# Altium schematic sheet mcu.SchDoc
size A2
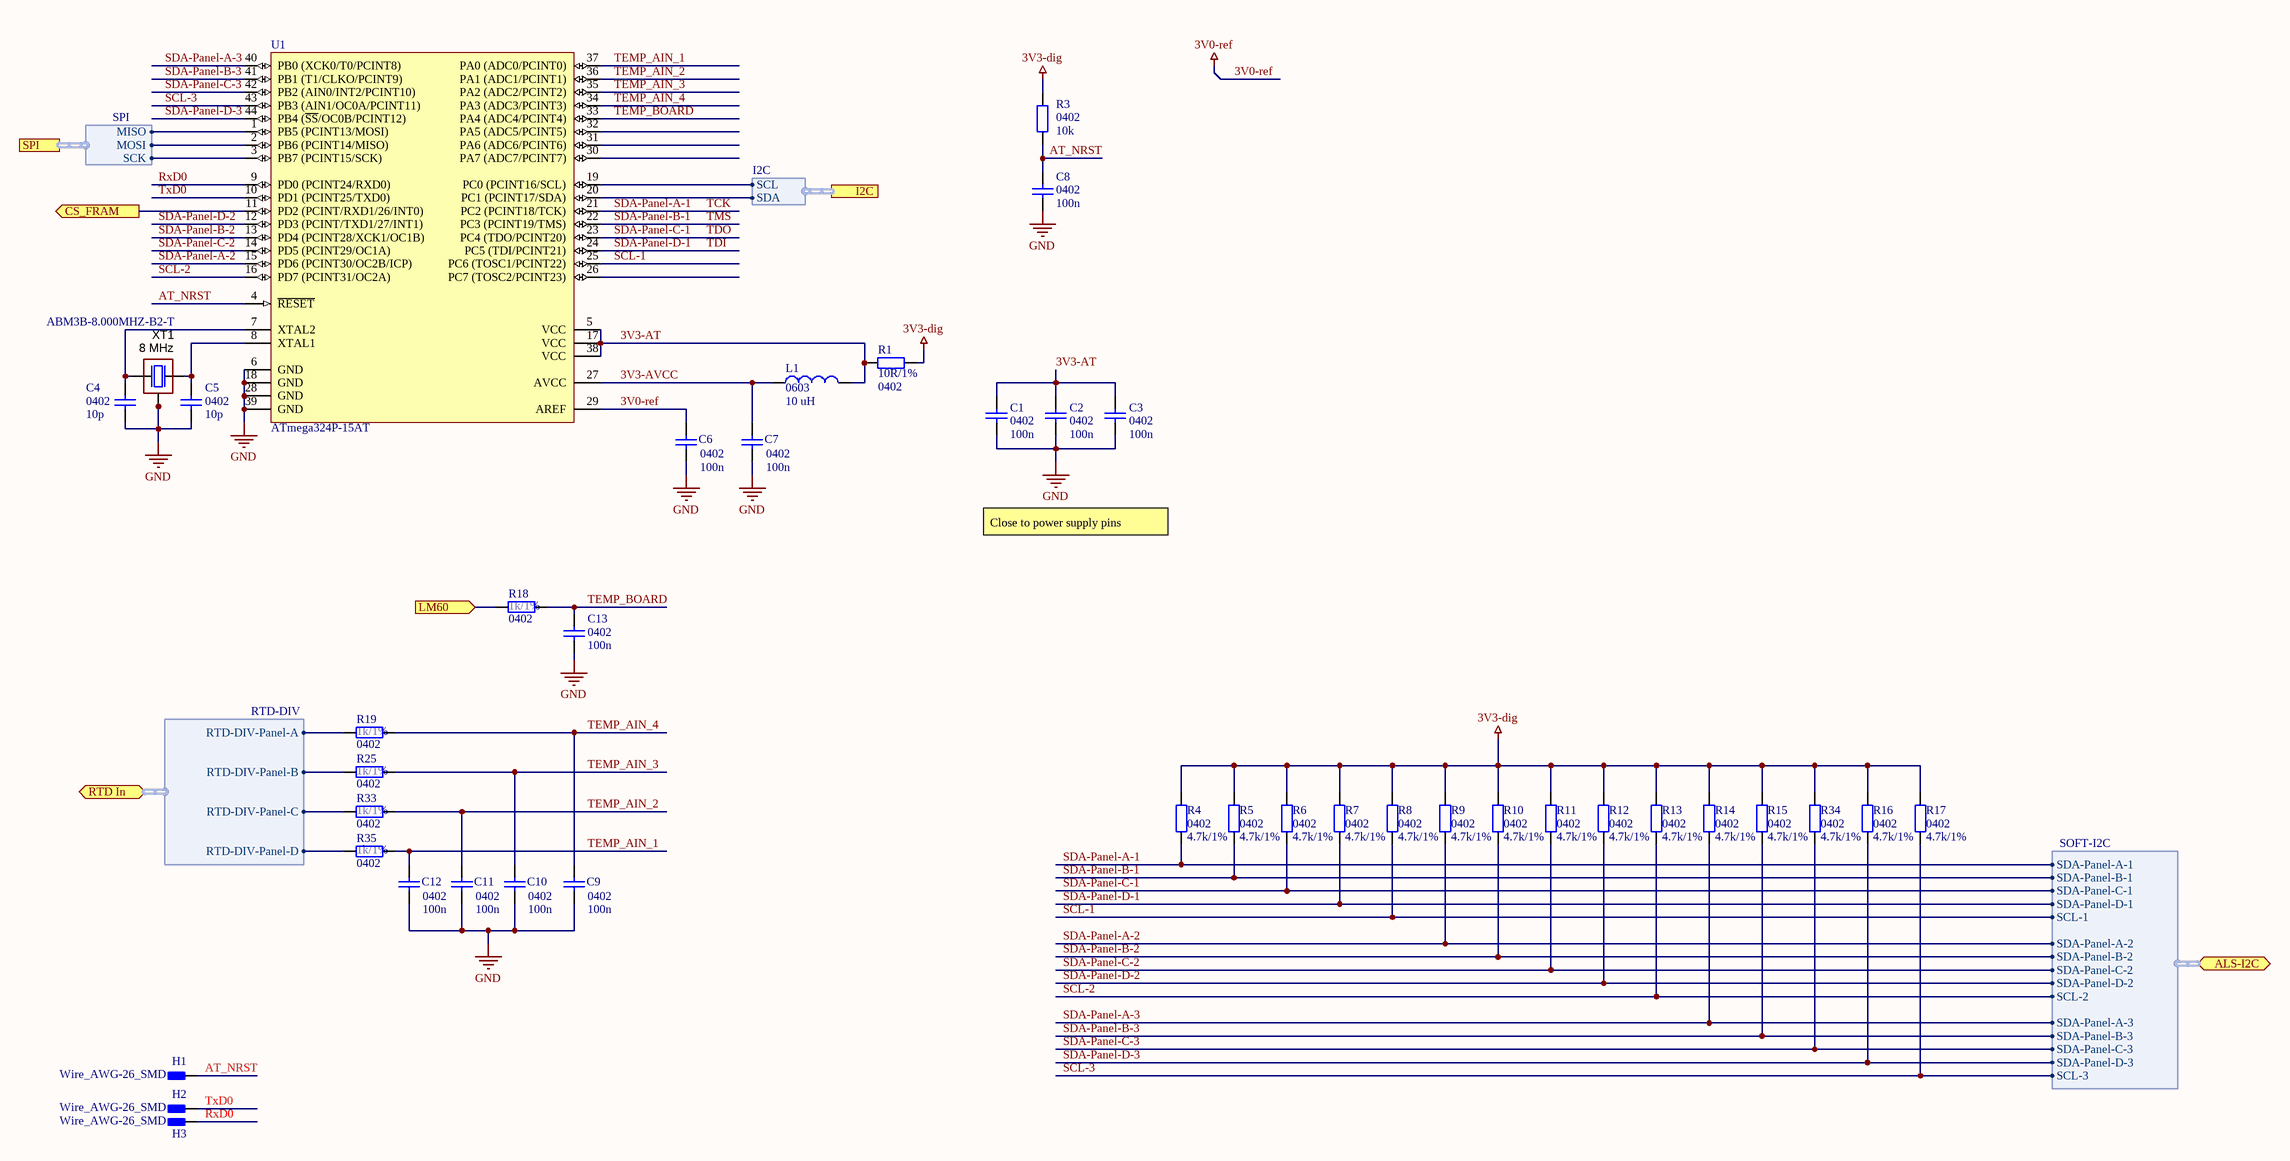
[diagram p0: mcu.SchDoc]

## Parts
C1  0402  value 100n  [SMD_Capacitor_0402]
C2  0402  value 100n  [SMD_Capacitor_0402]
C3  0402  value 100n  [SMD_Capacitor_0402]
C4  0402  value 10p  [SMD_Capacitor_0402]
C5  0402  value 10p  [SMD_Capacitor_0402]
C6  0402  value 100n  [SMD_Capacitor_0402]
C7  0402  value 100n  [SMD_Capacitor_0402]
C8  0402  value 100n  [SMD_Capacitor_0402]
C9  0402  value 100n  [SMD_Capacitor_0402]
C10  0402  value 100n  [SMD_Capacitor_0402]
C11  0402  value 100n  [SMD_Capacitor_0402]
C12  0402  value 100n  [SMD_Capacitor_0402]
C13  0402  value 100n  [SMD_Capacitor_0402]
H1  Wire_AWG-26_SMD  [Wire_AWG-26_SMD]
H2  Wire_AWG-26_SMD  [Wire_AWG-26_SMD]
H3  Wire_AWG-26_SMD  [Wire_AWG-26_SMD]
L1  10 uH  PackageReference: 0603  [SMD_Resistor_0603]
R1  Package: 0402  [SMD_Resistor_0402]  (hidden comment: 10R/1%)
R3  0402  value 10k  [SMD_Capacitor_0402]
R4  Package: 0402  [SMD_Resistor_0402]  (hidden comment: 4.7k/1%)
R5  Package: 0402  [SMD_Resistor_0402]  (hidden comment: 4.7k/1%)
R6  Package: 0402  [SMD_Resistor_0402]  (hidden comment: 4.7k/1%)
R7  Package: 0402  [SMD_Resistor_0402]  (hidden comment: 4.7k/1%)
R8  Package: 0402  [SMD_Resistor_0402]  (hidden comment: 4.7k/1%)
R9  Package: 0402  [SMD_Resistor_0402]  (hidden comment: 4.7k/1%)
R10  Package: 0402  [SMD_Resistor_0402]  (hidden comment: 4.7k/1%)
R11  Package: 0402  [SMD_Resistor_0402]  (hidden comment: 4.7k/1%)
R12  Package: 0402  [SMD_Resistor_0402]  (hidden comment: 4.7k/1%)
R13  Package: 0402  [SMD_Resistor_0402]  (hidden comment: 4.7k/1%)
R14  Package: 0402  [SMD_Resistor_0402]  (hidden comment: 4.7k/1%)
R15  Package: 0402  [SMD_Resistor_0402]  (hidden comment: 4.7k/1%)
R16  Package: 0402  [SMD_Resistor_0402]  (hidden comment: 4.7k/1%)
R17  Package: 0402  [SMD_Resistor_0402]  (hidden comment: 4.7k/1%)
R18  Package: 0402  [SMD_Resistor_0402]  (hidden comment: 1k/1%)
R19  Package: 0402  [SMD_Resistor_0402]  (hidden comment: 1k/1%)
R25  Package: 0402  [SMD_Resistor_0402]  (hidden comment: 1k/1%)
R33  Package: 0402  [SMD_Resistor_0402]  (hidden comment: 1k/1%)
R34  Package: 0402  [SMD_Resistor_0402]  (hidden comment: 4.7k/1%)
R35  Package: 0402  [SMD_Resistor_0402]  (hidden comment: 1k/1%)
U1  ATmega324P-15AT  [44ML_N]
XT1  8 MHz  [SMD, 5mm x 3.2mm]

## Ports
ALS-I2C (harness SOFT-I2C), CS_FRAM (out), I2C (harness I2C), LM60 (in), RTD In (harness RTD-DIV), SPI (harness SPI)

## Harnesses
SPI: MOSI, MISO, SCK
I2C: SCL, SDA
RTD-DIV: RTD-DIV-Panel-A, RTD-DIV-Panel-B, RTD-DIV-Panel-C, RTD-DIV-Panel-D
SOFT-I2C: SDA-Panel-A-1, SDA-Panel-D-1, SDA-Panel-B-1, SDA-Panel-C-1, SCL-1, SDA-Panel-A-2, SDA-Panel-D-2, SDA-Panel-B-2, SDA-Panel-C-2, SCL-2, SDA-Panel-A-3, SDA-Panel-D-3, SDA-Panel-B-3, SDA-Panel-C-3, SCL-3

## Nets
3V0-ref: C6.2 U1.29(AREF)
3V3-dig: R1.1 R3.2 R4.1 R5.1 R6.1 R7.1 R8.1 R9.1 R10.1 R11.1 R12.1 R13.1 R14.1 R15.1 R16.1 R17.1 R34.1
GND: C1.1 C2.1 C3.1 C4.1 C5.1 C6.1 C7.1 C8.1 C9.1 C10.1 C11.1 C12.1 C13.1 U1.6(GND) U1.18(GND) U1.28(GND) U1.39(GND) XT1.3(GND) XT1.4(GND)
3V3-AT: C1.2 C2.2 C3.2 L1.2 R1.2 U1.5(VCC) U1.17(VCC) U1.38(VCC)
3V3-AVCC: C7.2 L1.1 U1.27(AVCC)
AT_NRST: C8.2 H1.1 R3.1 U1.4(~{RESET})
CS_FRAM: U1.11(PD2_(PCINT/RXD1/26/INT0)) ; port CS_FRAM
LM60: R18.1 ; port LM60
RxD0: H3.1 U1.9(PD0_(PCINT24/RXD0))
SCL-1: R8.2 U1.25(PC6_(TOSC1/PCINT22)) ; port ALS-I2C.SCL-1
SCL-2: R13.2 U1.16(PD7_(PCINT31/OC2A)) ; port ALS-I2C.SCL-2
SCL-3: R17.2 U1.43(PB3_(AIN1/OC0A/PCINT11)) ; port ALS-I2C.SCL-3
SDA-Panel-A-1: R4.2 U1.21(PC2_(PCINT18/TCK)) ; port ALS-I2C.SDA-Panel-A-1  [also labelled TCK]
SDA-Panel-A-2: R9.2 U1.15(PD6_(PCINT30/OC2B/ICP)) ; port ALS-I2C.SDA-Panel-A-2
SDA-Panel-A-3: R14.2 U1.40(PB0_(XCK0/T0/PCINT8)) ; port ALS-I2C.SDA-Panel-A-3
SDA-Panel-B-1: R5.2 U1.22(PC3_(PCINT19/TMS)) ; port ALS-I2C.SDA-Panel-B-1  [also labelled TMS]
SDA-Panel-B-2: R10.2 U1.13(PD4_(PCINT28/XCK1/OC1B)) ; port ALS-I2C.SDA-Panel-B-2
SDA-Panel-B-3: R15.2 U1.41(PB1_(T1/CLKO/PCINT9)) ; port ALS-I2C.SDA-Panel-B-3
SDA-Panel-C-1: R6.2 U1.23(PC4_(TDO/PCINT20)) ; port ALS-I2C.SDA-Panel-C-1  [also labelled TDO]
SDA-Panel-C-2: R11.2 U1.14(PD5_(PCINT29/OC1A)) ; port ALS-I2C.SDA-Panel-C-2
SDA-Panel-C-3: R34.2 U1.42(PB2_(AIN0/INT2/PCINT10)) ; port ALS-I2C.SDA-Panel-C-3
SDA-Panel-D-1: R7.2 U1.24(PC5_(TDI/PCINT21)) ; port ALS-I2C.SDA-Panel-D-1  [also labelled TDI]
SDA-Panel-D-2: R12.2 U1.12(PD3_(PCINT/TXD1/27/INT1)) ; port ALS-I2C.SDA-Panel-D-2
SDA-Panel-D-3: R16.2 U1.44(PB4_(~{SS}/OC0B/PCINT12)) ; port ALS-I2C.SDA-Panel-D-3
TEMP_AIN_1: C12.2 R35.2 U1.37(PA0_(ADC0/PCINT0))
TEMP_AIN_2: C11.2 R33.2 U1.36(PA1_(ADC1/PCINT1))
TEMP_AIN_3: C10.2 R25.2 U1.35(PA2_(ADC2/PCINT2))
TEMP_AIN_4: C9.2 R19.2 U1.34(PA3_(ADC3/PCINT3))
TEMP_BOARD: C13.2 R18.2 U1.33(PA4_(ADC4/PCINT4))
TxD0: H2.1 U1.10(PD1_(PCINT25/TXD0))
NetC4_2: C4.2 U1.7(XTAL2) XT1.1(inp)
NetC5_2: C5.2 U1.8(XTAL1) XT1.2(out)
NetR19_1: R19.1 ; port RTD In.RTD-DIV-Panel-A
NetR25_1: R25.1 ; port RTD In.RTD-DIV-Panel-B
NetR33_1: R33.1 ; port RTD In.RTD-DIV-Panel-C
NetR35_1: R35.1 ; port RTD In.RTD-DIV-Panel-D
NetU1_1: U1.1(PB5_(PCINT13/MOSI)) ; port SPI.MISO
NetU1_2: U1.2(PB6_(PCINT14/MISO)) ; port SPI.MOSI
NetU1_3: U1.3(PB7_(PCINT15/SCK)) ; port SPI.SCK
NetU1_19: U1.19(PC0_(PCINT16/SCL)) ; port I2C.SCL
NetU1_20: U1.20(PC1_(PCINT17/SDA)) ; port I2C.SDA

Not connected (* = marked no-connect by the designer): U1 26(PC7_(TOSC2/PCINT23)) 30(PA7_(ADC7/PCINT7)) 31(PA6_(ADC6/PCINT6)) 32(PA5_(ADC5/PCINT5))

## Notes on the sheet
- Close to power supply pins
- Title:
- Sheet:
- of
- Author:
- Model:
- File name:
- Document Number:
- Checked by:
- Iss-Rev:
- Approved by:
- Date:

## Library data of the parts
C1-C3 C6-C13 = Cap: Capacitor; Published: 8-Jun-2000; LatestRevisionDate: 17-Jul-2002; LatestRevisionNote: Re-released for DXP Platform.; PackageReference: RAD-0.3; Publisher: Altium Limited; PackageDescription: Radial Cap, Thru-Hole; 2 Leads; 0.3 in Pin Spacing
C4 C5 = Cap1: Capacitor; Published: 8-Jun-2000; LatestRevisionDate: 17-Jul-2002; LatestRevisionNote: Re-released for DXP Platform.; PackageReference: RAD-0.3; Publisher: Altium Limited; PackageDescription: Radial Cap, Thru-Hole; 2 Leads; 0.3 in Pin Spacing
H1-H3 = Wire_AWG-26_SMD: SMD wire solder point.; Value: Wire_AWG-26_SMD
L1 = Inductor: Code_IEC: 1005; Published: 8-Jun-2000; LatestRevisionDate: 29-May-2009; LatestRevisionNote: IPC-7351 Footprint Added.; Publisher: Altium Limited; PackageDescription: Chip Inductor; Code_JEITA: 0402; Value: 10 uH
R1 = CRCW040210R0FKxxxx: 10R/1% Vishay CRCW 0402 Resistor. 63mW, 100ppm, 50V.; Manufacturer: Vishay; ManufacturerPartNumber: CRCW040210R0FKxxxx; Value: 10R/1%
R3 = Res2: Resistor; Published: 8-Jun-2000; LatestRevisionDate: 17-Jul-2002; LatestRevisionNote: Re-released for DXP Platform.; PackageReference: AXIAL-0.4; Publisher: Altium Limited; PackageDescription: Axial Device, Thru-Hole; 2 Leads; 0.4 in Pin Spacing
R4-R17 R34 = CRCW04024K70FKxxxx: 4.7k/1% Vishay CRCW 0402 Resistor. 63mW, 100ppm, 50V.; ManufacturerPartNumber: CRCW04024K70FKxxxx; Manufacturer: Vishay; Value: 4.7k/1%
R18 R19 R25 R33 R35 = CRCW04021K00FKxxxx: 1k/1% Vishay CRCW 0402 Resistor. 63mW, 100ppm, 50V.; Manufacturer: Vishay; ManufacturerPartNumber: CRCW04021K00FKxxxx; Value: 1k/1%
U1 = ATmega324P-15AT: 8-bit Automotive AVR Microcontroller, 32KB Flash, 1KB EEPROM, 2KB SRAM, Automotive Quality (-40°C to +85°C), 44-Pin TQFP; DatasheetVersion: revF, Sep-2009; PackageVersion: rev.G, Jul-2007; PackageReference: 44ML; PackageDescription: 44-Pin Plastic Thin Quad Flat Pack, 10 x 10 x 1.0 mm Body, 0.8 mm Pitch (TQFP); ComponentLink1Description: Manufacturer URL; ComponentLink1URL: http://www.atmel.com/; ComponentLink2Description: ATmega164P/324P/644P Datasheet; ComponentLink2URL: http://www.atmel.com/dyn/resources/prod_documents/doc7674.pdf; ComponentLink3Description: ATmega164P/324P/644P Summary; ComponentLink3URL: http://www.atmel.com/dyn/resources/prod_documents/7674S.pdf
XT1 = ABM3B-8.000MHZ-B2-T: Resonator Ceramic; value: 8 MHz; Manufacturer Part Number: ABM3B-8.000MHZ-B2-T